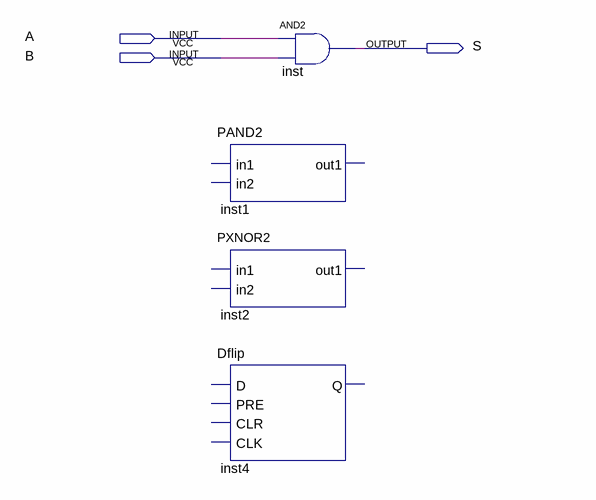
[diagram p0: schematic sheet]
// Quartus schematic NewProject.bdf as structural Verilog: 4 symbols, 3 pins
module NewProject (
  input  A,
  input  B,
  output S
);

  PAND2 inst1 ();  // open: in1, in2, out1
  PXNOR2 inst2 ();  // open: in1, in2, out1
  Dflip inst4 ();  // open: D, PRE, CLR, CLK, Q
  and inst (S, A, B);
endmodule
